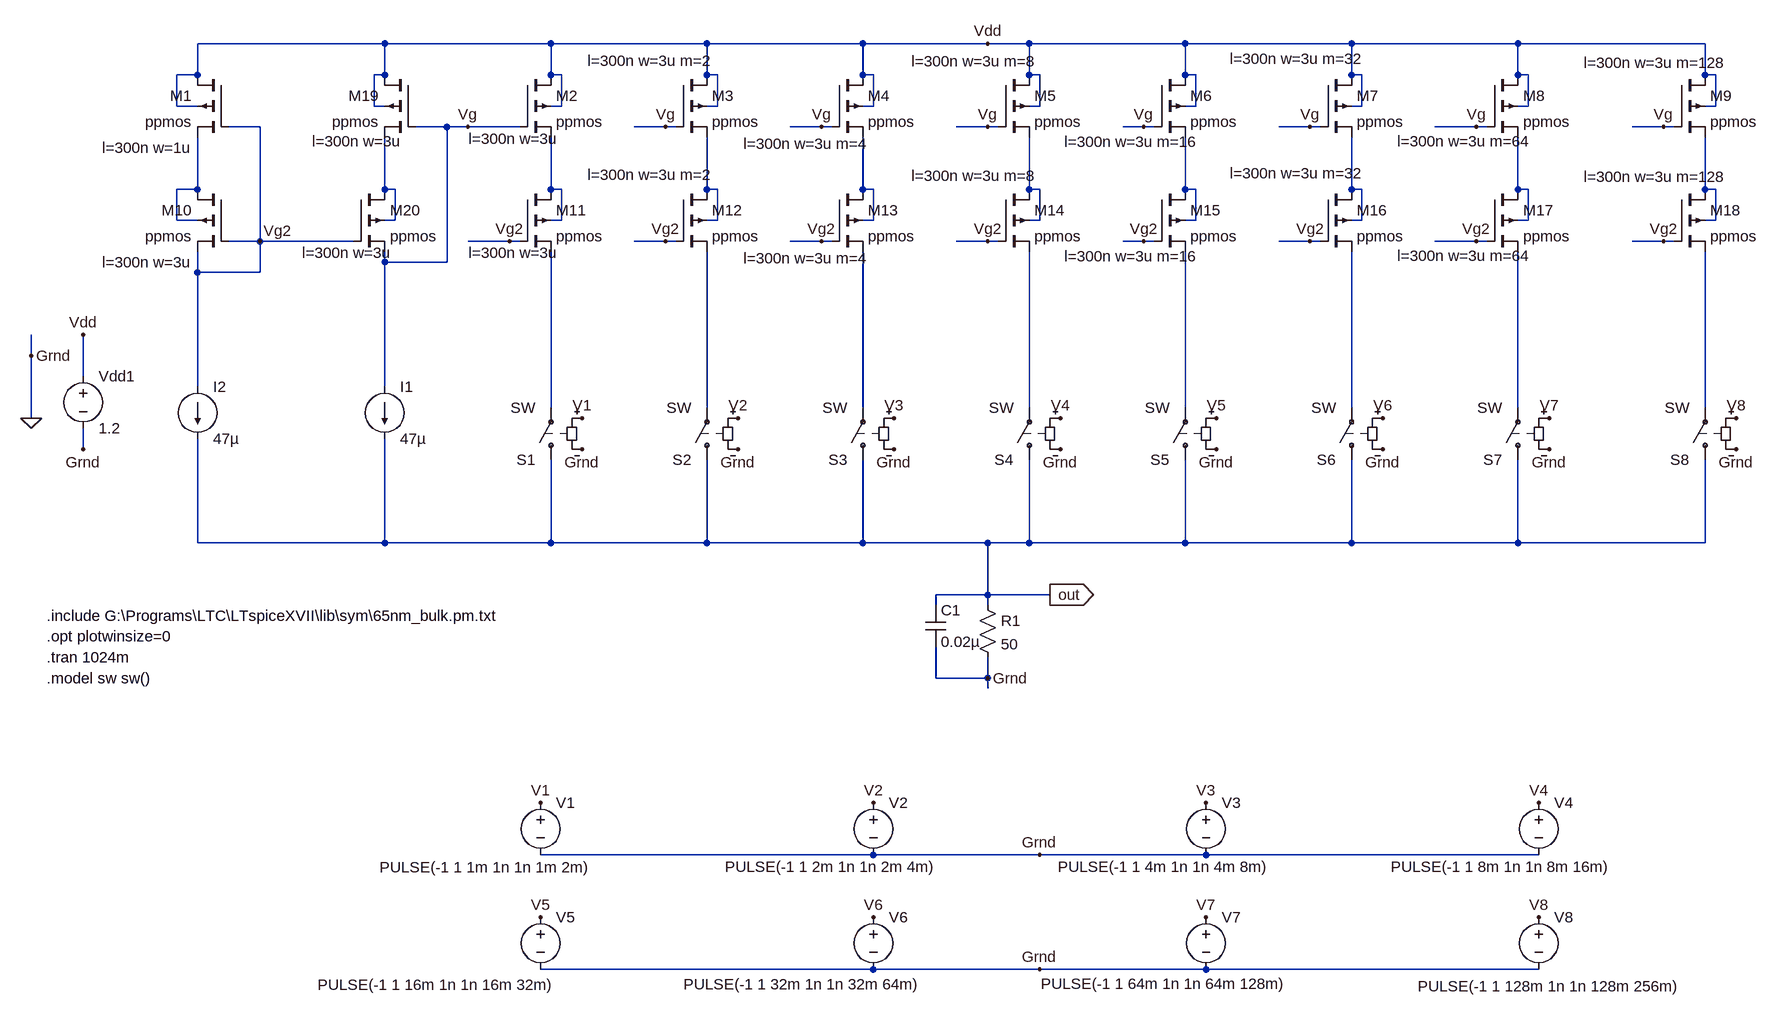
[diagram p0: schematic DAC_lv_sooch_cascode.asc]
DAC_lv_sooch_cascode.asc, the LTspice schematic file:
Version 4
SHEET 1 1500 748
WIRE -656 -720 -944 -720
WIRE -400 -720 -656 -720
WIRE -160 -720 -400 -720
WIRE 80 -720 -160 -720
WIRE 272 -720 80 -720
WIRE 336 -720 272 -720
WIRE 576 -720 336 -720
WIRE 832 -720 576 -720
WIRE 1088 -720 832 -720
WIRE 1376 -720 1088 -720
WIRE -944 -672 -944 -720
WIRE -944 -672 -976 -672
WIRE -656 -672 -656 -720
WIRE -656 -672 -672 -672
WIRE -400 -672 -400 -720
WIRE -384 -672 -400 -672
WIRE -160 -672 -160 -720
WIRE -144 -672 -160 -672
WIRE 80 -672 80 -720
WIRE 96 -672 80 -672
WIRE 336 -672 336 -720
WIRE 352 -672 336 -672
WIRE 576 -672 576 -720
WIRE 592 -672 576 -672
WIRE 832 -672 832 -720
WIRE 848 -672 832 -672
WIRE 1088 -672 1088 -720
WIRE 1104 -672 1088 -672
WIRE 1376 -672 1376 -720
WIRE 1392 -672 1376 -672
WIRE -976 -624 -976 -672
WIRE -944 -624 -976 -624
WIRE -672 -624 -672 -672
WIRE -656 -624 -672 -624
WIRE -384 -624 -384 -672
WIRE -384 -624 -400 -624
WIRE -144 -624 -144 -672
WIRE -144 -624 -160 -624
WIRE 96 -624 96 -672
WIRE 96 -624 80 -624
WIRE 352 -624 352 -672
WIRE 352 -624 336 -624
WIRE 592 -624 592 -672
WIRE 592 -624 576 -624
WIRE 848 -624 848 -672
WIRE 848 -624 832 -624
WIRE 1104 -624 1104 -672
WIRE 1104 -624 1088 -624
WIRE 1392 -624 1392 -672
WIRE 1392 -624 1376 -624
WIRE -848 -592 -896 -592
WIRE -560 -592 -608 -592
WIRE -528 -592 -560 -592
WIRE -448 -592 -528 -592
WIRE -224 -592 -272 -592
WIRE -208 -592 -224 -592
WIRE 16 -592 -32 -592
WIRE 32 -592 16 -592
WIRE 272 -592 224 -592
WIRE 288 -592 272 -592
WIRE 512 -592 480 -592
WIRE 528 -592 512 -592
WIRE 768 -592 720 -592
WIRE 784 -592 768 -592
WIRE 1024 -592 960 -592
WIRE 1040 -592 1024 -592
WIRE 1312 -592 1264 -592
WIRE 1328 -592 1312 -592
WIRE -944 -496 -944 -576
WIRE -944 -496 -976 -496
WIRE -656 -496 -656 -576
WIRE -640 -496 -656 -496
WIRE -400 -496 -400 -576
WIRE -384 -496 -400 -496
WIRE -160 -496 -160 -576
WIRE -144 -496 -160 -496
WIRE 80 -496 80 -576
WIRE 96 -496 80 -496
WIRE 336 -496 336 -576
WIRE 352 -496 336 -496
WIRE 576 -496 576 -576
WIRE 592 -496 576 -496
WIRE 832 -496 832 -576
WIRE 848 -496 832 -496
WIRE 1088 -496 1088 -576
WIRE 1104 -496 1088 -496
WIRE 1376 -496 1376 -576
WIRE 1392 -496 1376 -496
WIRE -976 -448 -976 -496
WIRE -944 -448 -976 -448
WIRE -640 -448 -640 -496
WIRE -640 -448 -656 -448
WIRE -384 -448 -384 -496
WIRE -384 -448 -400 -448
WIRE -144 -448 -144 -496
WIRE -144 -448 -160 -448
WIRE 96 -448 96 -496
WIRE 96 -448 80 -448
WIRE 352 -448 352 -496
WIRE 352 -448 336 -448
WIRE 592 -448 592 -496
WIRE 592 -448 576 -448
WIRE 848 -448 848 -496
WIRE 848 -448 832 -448
WIRE 1104 -448 1104 -496
WIRE 1104 -448 1088 -448
WIRE 1392 -448 1392 -496
WIRE 1392 -448 1376 -448
WIRE -848 -416 -848 -592
WIRE -848 -416 -896 -416
WIRE -704 -416 -848 -416
WIRE -464 -416 -528 -416
WIRE -448 -416 -464 -416
WIRE -224 -416 -272 -416
WIRE -208 -416 -224 -416
WIRE 16 -416 -32 -416
WIRE 32 -416 16 -416
WIRE 272 -416 224 -416
WIRE 288 -416 272 -416
WIRE 512 -416 480 -416
WIRE 528 -416 512 -416
WIRE 768 -416 720 -416
WIRE 784 -416 768 -416
WIRE 1024 -416 960 -416
WIRE 1040 -416 1024 -416
WIRE 1312 -416 1264 -416
WIRE 1328 -416 1312 -416
WIRE -656 -384 -656 -400
WIRE -560 -384 -560 -592
WIRE -560 -384 -656 -384
WIRE -944 -368 -944 -400
WIRE -848 -368 -848 -416
WIRE -848 -368 -944 -368
WIRE -1200 -240 -1200 -272
WIRE -1120 -208 -1120 -272
WIRE -944 -192 -944 -368
WIRE -656 -192 -656 -384
WIRE -400 -160 -400 -400
WIRE -160 -160 -160 -400
WIRE 80 -160 80 -400
WIRE 336 -160 336 -400
WIRE 576 -160 576 -400
WIRE 832 -160 832 -400
WIRE 1088 -160 1088 -400
WIRE 1376 -160 1376 -400
WIRE -1200 -144 -1200 -240
WIRE -1120 -96 -1120 -128
WIRE -944 48 -944 -112
WIRE -656 48 -656 -112
WIRE -656 48 -944 48
WIRE -400 48 -400 -80
WIRE -400 48 -656 48
WIRE -160 48 -160 -80
WIRE -160 48 -400 48
WIRE 80 48 80 -80
WIRE 80 48 -160 48
WIRE 272 48 80 48
WIRE 336 48 336 -80
WIRE 336 48 272 48
WIRE 576 48 576 -80
WIRE 576 48 336 48
WIRE 832 48 832 -80
WIRE 832 48 576 48
WIRE 1088 48 1088 -80
WIRE 1088 48 832 48
WIRE 1376 48 1376 -80
WIRE 1376 48 1088 48
WIRE 272 128 272 48
WIRE 272 128 192 128
WIRE 368 128 272 128
WIRE 192 144 192 128
WIRE 272 144 272 128
WIRE 192 256 192 208
WIRE 272 256 272 224
WIRE 272 256 192 256
WIRE 272 272 272 256
WIRE 96 528 -416 528
WIRE 352 528 96 528
WIRE 608 528 352 528
WIRE 1120 528 608 528
WIRE 96 704 -416 704
WIRE 352 704 96 704
WIRE 608 704 352 704
WIRE 1120 704 608 704
FLAG -1200 -144 0
FLAG -1120 -272 Vdd
FLAG -1200 -240 Grnd
FLAG -1120 -96 Grnd
FLAG 272 256 Grnd
FLAG 352 528 Grnd
FLAG 352 704 Grnd
FLAG -352 -96 Grnd
FLAG -112 -96 Grnd
FLAG 128 -96 Grnd
FLAG 384 -96 Grnd
FLAG 624 -96 Grnd
FLAG 880 -96 Grnd
FLAG 1136 -96 Grnd
FLAG 1424 -96 Grnd
FLAG -416 448 V1
FLAG -352 -144 V1
FLAG 96 448 V2
FLAG -112 -144 V2
FLAG 128 -144 V3
FLAG 384 -144 V4
FLAG 624 -144 V5
FLAG 880 -144 V6
FLAG 1136 -144 V7
FLAG 1424 -144 V8
FLAG 1120 448 V4
FLAG 608 448 V3
FLAG -416 624 V5
FLAG 96 624 V6
FLAG 608 624 V7
FLAG 1120 624 V8
FLAG 368 128 out
IOPIN 368 128 Out
FLAG 272 -720 Vdd
FLAG -528 -592 Vg
FLAG -224 -592 Vg
FLAG 16 -592 Vg
FLAG 272 -592 Vg
FLAG 512 -592 Vg
FLAG 768 -592 Vg
FLAG 1024 -592 Vg
FLAG 1312 -592 Vg
FLAG -848 -416 Vg2
FLAG -224 -416 Vg2
FLAG 16 -416 Vg2
FLAG 272 -416 Vg2
FLAG 512 -416 Vg2
FLAG 768 -416 Vg2
FLAG 1024 -416 Vg2
FLAG 1312 -416 Vg2
FLAG -464 -416 Vg2
SYMBOL voltage -1120 -224 R0
WINDOW 123 0 0 Left 0
WINDOW 39 0 0 Left 0
SYMATTR InstName Vdd1
SYMATTR Value 1.2
SYMBOL current -656 -192 R0
WINDOW 123 0 0 Left 0
WINDOW 39 0 0 Left 0
SYMATTR InstName I1
SYMATTR Value 47µ
SYMBOL res 256 128 R0
SYMATTR InstName R1
SYMATTR Value 50
SYMBOL sw -400 -64 R180
SYMATTR InstName S1
SYMBOL sw -160 -64 R180
SYMATTR InstName S2
SYMBOL sw 80 -64 R180
SYMATTR InstName S3
SYMBOL sw 336 -64 R180
SYMATTR InstName S4
SYMBOL sw 576 -64 R180
SYMATTR InstName S5
SYMBOL sw 832 -64 R180
SYMATTR InstName S6
SYMBOL sw 1088 -64 R180
SYMATTR InstName S7
SYMBOL sw 1376 -64 R180
SYMATTR InstName S8
SYMBOL pmos4 -896 -672 M0
WINDOW 123 56 112 Left 2
SYMATTR Value2 l=300n w=1u
SYMATTR InstName M1
SYMATTR Value ppmos
SYMBOL pmos4 -448 -672 R0
WINDOW 123 -79 98 Left 2
SYMATTR Value2 l=300n w=3u
SYMATTR InstName M2
SYMATTR Value ppmos
SYMBOL pmos4 -208 -672 R0
WINDOW 123 -136 -22 Left 2
SYMATTR Value2 l=300n w=3u m=2
SYMATTR InstName M3
SYMATTR Value ppmos
SYMBOL pmos4 32 -672 R0
WINDOW 123 -136 106 Left 2
SYMATTR Value2 l=300n w=3u m=4
SYMATTR InstName M4
SYMATTR Value ppmos
SYMBOL pmos4 288 -672 R0
WINDOW 123 -133 -21 Left 2
SYMATTR Value2 l=300n w=3u m=8
SYMATTR InstName M5
SYMATTR Value ppmos
SYMBOL pmos4 528 -672 R0
WINDOW 123 -138 103 Left 2
SYMATTR Value2 l=300n w=3u m=16
SYMATTR InstName M6
SYMATTR Value ppmos
SYMBOL pmos4 784 -672 R0
WINDOW 123 -139 -25 Left 2
SYMATTR Value2 l=300n w=3u m=32
SYMATTR InstName M7
SYMATTR Value ppmos
SYMBOL pmos4 1040 -672 R0
WINDOW 123 -138 102 Left 2
SYMATTR Value2 l=300n w=3u m=64
SYMATTR InstName M8
SYMATTR Value ppmos
SYMBOL pmos4 1328 -672 R0
WINDOW 123 -139 -19 Left 2
SYMATTR Value2 l=300n w=3u m=128
SYMATTR InstName M9
SYMATTR Value ppmos
SYMBOL voltage -416 432 R0
WINDOW 3 -248 115 Left 2
WINDOW 123 0 0 Left 0
WINDOW 39 0 0 Left 0
SYMATTR Value PULSE(-1 1 1m 1n 1n 1m 2m)
SYMATTR InstName V1
SYMBOL voltage 96 432 R0
WINDOW 3 -228 114 Left 2
WINDOW 123 0 0 Left 0
WINDOW 39 0 0 Left 0
SYMATTR Value PULSE(-1 1 2m 1n 1n 2m 4m)
SYMATTR InstName V2
SYMBOL voltage 608 432 R0
WINDOW 3 -228 114 Left 2
WINDOW 123 0 0 Left 0
WINDOW 39 0 0 Left 0
SYMATTR Value PULSE(-1 1 4m 1n 1n 4m 8m)
SYMATTR InstName V3
SYMBOL voltage 1120 432 R0
WINDOW 3 -228 114 Left 2
WINDOW 123 0 0 Left 0
WINDOW 39 0 0 Left 0
SYMATTR Value PULSE(-1 1 8m 1n 1n 8m 16m)
SYMATTR InstName V4
SYMBOL voltage -416 608 R0
WINDOW 3 -343 120 Left 2
WINDOW 123 0 0 Left 0
WINDOW 39 0 0 Left 0
SYMATTR Value PULSE(-1 1 16m 1n 1n 16m 32m)
SYMATTR InstName V5
SYMBOL voltage 96 608 R0
WINDOW 3 -292 119 Left 2
WINDOW 123 0 0 Left 0
WINDOW 39 0 0 Left 0
SYMATTR Value PULSE(-1 1 32m 1n 1n 32m 64m)
SYMATTR InstName V6
SYMBOL voltage 608 608 R0
WINDOW 3 -254 118 Left 2
WINDOW 123 0 0 Left 0
WINDOW 39 0 0 Left 0
SYMATTR Value PULSE(-1 1 64m 1n 1n 64m 128m)
SYMATTR InstName V7
SYMBOL voltage 1120 608 R0
WINDOW 3 -186 122 Left 2
WINDOW 123 0 0 Left 0
WINDOW 39 0 0 Left 0
SYMATTR Value PULSE(-1 1 128m 1n 1n 128m 256m)
SYMATTR InstName V8
SYMBOL pmos4 -896 -496 M0
WINDOW 123 56 112 Left 2
SYMATTR Value2 l=300n w=3u
SYMATTR InstName M10
SYMATTR Value ppmos
SYMBOL pmos4 -448 -496 R0
WINDOW 123 -79 98 Left 2
SYMATTR Value2 l=300n w=3u
SYMATTR InstName M11
SYMATTR Value ppmos
SYMBOL pmos4 -208 -496 R0
WINDOW 123 -136 -22 Left 2
SYMATTR Value2 l=300n w=3u m=2
SYMATTR InstName M12
SYMATTR Value ppmos
SYMBOL pmos4 32 -496 R0
WINDOW 123 -136 106 Left 2
SYMATTR Value2 l=300n w=3u m=4
SYMATTR InstName M13
SYMATTR Value ppmos
SYMBOL pmos4 288 -496 R0
WINDOW 123 -133 -21 Left 2
SYMATTR Value2 l=300n w=3u m=8
SYMATTR InstName M14
SYMATTR Value ppmos
SYMBOL pmos4 528 -496 R0
WINDOW 123 -138 103 Left 2
SYMATTR Value2 l=300n w=3u m=16
SYMATTR InstName M15
SYMATTR Value ppmos
SYMBOL pmos4 784 -496 R0
WINDOW 123 -139 -25 Left 2
SYMATTR Value2 l=300n w=3u m=32
SYMATTR InstName M16
SYMATTR Value ppmos
SYMBOL pmos4 1040 -496 R0
WINDOW 123 -138 102 Left 2
SYMATTR Value2 l=300n w=3u m=64
SYMATTR InstName M17
SYMATTR Value ppmos
SYMBOL pmos4 1328 -496 R0
WINDOW 123 -139 -19 Left 2
SYMATTR Value2 l=300n w=3u m=128
SYMATTR InstName M18
SYMATTR Value ppmos
SYMBOL cap 176 144 R0
SYMATTR InstName C1
SYMATTR Value 0.02µ
SYMBOL pmos4 -608 -672 M0
WINDOW 123 21 102 Left 2
SYMATTR Value2 l=300n w=3u
SYMATTR InstName M19
SYMATTR Value ppmos
SYMBOL pmos4 -704 -496 R0
WINDOW 123 -79 98 Left 2
SYMATTR Value2 l=300n w=3u
SYMATTR InstName M20
SYMATTR Value ppmos
SYMBOL current -944 -192 R0
WINDOW 123 0 0 Left 0
WINDOW 39 0 0 Left 0
SYMATTR InstName I2
SYMATTR Value 47µ
TEXT -1176 160 Left 2 !.include G:\\Programs\\LTC\\LTspiceXVII\\lib\\sym\\65nm_bulk.pm.txt
TEXT -1176 192 Left 2 !.opt plotwinsize=0
TEXT -1176 224 Left 2 !.tran 1024m
TEXT -1176 256 Left 2 !.model sw sw()

The netlist it stands for:
* DAC_lv_sooch_cascode.asc
Vdd1 Vdd 0 1.2
I1 Vg out 47µ
R1 out 0 50
S1 out N011 V1 0 SW
S2 out N012 V2 0 SW
S3 out N013 V3 0 SW
S4 out N014 V4 0 SW
S5 out N015 V5 0 SW
S6 out N016 V6 0 SW
S7 out N017 V7 0 SW
S8 out N018 V8 0 SW
M1 Vdd Vg2 N001 Vdd ppmos l=300n w=1u
M2 Vdd Vg N003 Vdd ppmos l=300n w=3u
M3 Vdd Vg N004 Vdd ppmos l=300n w=3u m=2
M4 Vdd Vg N005 Vdd ppmos l=300n w=3u m=4
M5 Vdd Vg N006 Vdd ppmos l=300n w=3u m=8
M6 Vdd Vg N007 Vdd ppmos l=300n w=3u m=16
M7 Vdd Vg N008 Vdd ppmos l=300n w=3u m=32
M8 Vdd Vg N009 Vdd ppmos l=300n w=3u m=64
M9 Vdd Vg N010 Vdd ppmos l=300n w=3u m=128
V1 V1 0 PULSE(-1 1 1m 1n 1n 1m 2m)
V2 V2 0 PULSE(-1 1 2m 1n 1n 2m 4m)
V3 V3 0 PULSE(-1 1 4m 1n 1n 4m 8m)
V4 V4 0 PULSE(-1 1 8m 1n 1n 8m 16m)
V5 V5 0 PULSE(-1 1 16m 1n 1n 16m 32m)
V6 V6 0 PULSE(-1 1 32m 1n 1n 32m 64m)
V7 V7 0 PULSE(-1 1 64m 1n 1n 64m 128m)
V8 V8 0 PULSE(-1 1 128m 1n 1n 128m 256m)
M10 N001 Vg2 Vg2 N001 ppmos l=300n w=3u
M11 N003 Vg2 N011 N003 ppmos l=300n w=3u
M12 N004 Vg2 N012 N004 ppmos l=300n w=3u m=2
M13 N005 Vg2 N013 N005 ppmos l=300n w=3u m=4
M14 N006 Vg2 N014 N006 ppmos l=300n w=3u m=8
M15 N007 Vg2 N015 N007 ppmos l=300n w=3u m=16
M16 N008 Vg2 N016 N008 ppmos l=300n w=3u m=32
M17 N009 Vg2 N017 N009 ppmos l=300n w=3u m=64
M18 N010 Vg2 N018 N010 ppmos l=300n w=3u m=128
C1 out 0 0.02µ
M19 Vdd Vg N002 Vdd ppmos l=300n w=3u
M20 N002 Vg2 Vg N002 ppmos l=300n w=3u
I2 Vg2 out 47µ
.model NMOS NMOS
.model PMOS PMOS
.lib standard.mos
.include G:\Programs\LTC\LTspiceXVII\lib\sym\65nm_bulk.pm.txt
.opt plotwinsize=0
.tran 1024m
.model sw sw()
.backanno
.end